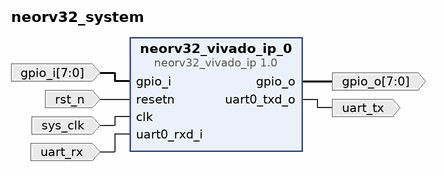
[diagram p0: block diagram of the top level]
# Vivado block design neorv32_system, xc7a100tcsg324-1, Vivado 2024.1
create_bd_design neorv32_system

create_bd_port -dir I -type clk sys_clk
set_property -dict {CONFIG.FREQ_HZ 100000000} [get_bd_ports sys_clk]
create_bd_port -dir I -type rst rst_n
create_bd_port -dir I -from 7 -to 0 gpio_i
create_bd_port -dir O -from 7 -to 0 gpio_o
create_bd_port -dir I uart_rx
create_bd_port -dir O uart_tx

create_bd_cell -type ip -vlnv NEORV32:user:neorv32_vivado_ip:1.0 neorv32_vivado_ip_0
set_property -dict [list \
  CONFIG.IO_CLINT_EN true \
  CONFIG.IO_GPIO_EN true \
  CONFIG.IO_GPIO_IN_NUM 8 \
  CONFIG.IO_GPIO_OUT_NUM 8 \
  CONFIG.IO_UART0_EN true \
  CONFIG.MEM_INT_DMEM_EN true \
  CONFIG.MEM_INT_IMEM_EN true \
  CONFIG.OCD_EN false \
  CONFIG.RISCV_ISA_C true \
  CONFIG.RISCV_ISA_E false \
  CONFIG.RISCV_ISA_M true \
  CONFIG.RISCV_ISA_Zicntr true \
  CONFIG.XBUS_EN false \
] [get_bd_cells neorv32_vivado_ip_0]

# ---- connections ----

connect_bd_net [get_bd_ports gpio_i] [get_bd_pins neorv32_vivado_ip_0/gpio_i]
connect_bd_net [get_bd_pins neorv32_vivado_ip_0/uart0_txd_o] [get_bd_ports uart_tx]
connect_bd_net -net neorv32_vivado_ip_1_gpio_o [get_bd_pins neorv32_vivado_ip_0/gpio_o] [get_bd_ports gpio_o]
connect_bd_net [get_bd_ports rst_n] [get_bd_pins neorv32_vivado_ip_0/resetn]
connect_bd_net [get_bd_ports sys_clk] [get_bd_pins neorv32_vivado_ip_0/clk]
connect_bd_net [get_bd_ports uart_rx] [get_bd_pins neorv32_vivado_ip_0/uart0_rxd_i]

validate_bd_design
save_bd_design
